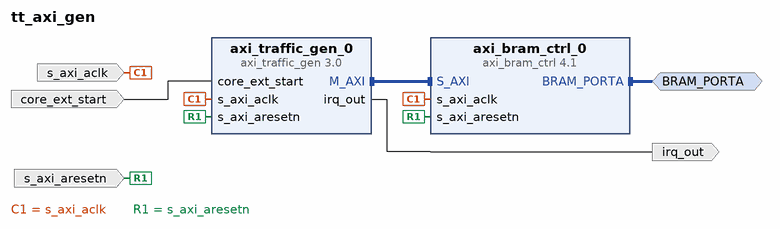
[diagram p0: block diagram of the top level]
# Vivado block design tt_axi_gen, xczu47dr-ffve1156-2LVI-i, Vivado 2020.2
create_bd_design tt_axi_gen

create_bd_intf_port -mode Master -vlnv xilinx.com:interface:bram_rtl:1.0 BRAM_PORTA
set_property -dict {CONFIG.MASTER_TYPE BRAM_CTRL} [get_bd_intf_ports BRAM_PORTA]
create_bd_port -dir I -type clk s_axi_aclk
create_bd_port -dir I -type rst s_axi_aresetn
create_bd_port -dir I core_ext_start
create_bd_port -dir O -type intr irq_out

create_bd_cell -type ip -vlnv xilinx.com:ip:axi_bram_ctrl:4.1 axi_bram_ctrl_0
set_property -dict {CONFIG.SINGLE_PORT_BRAM 1} [get_bd_cells axi_bram_ctrl_0]
create_bd_cell -type ip -vlnv xilinx.com:ip:axi_traffic_gen:3.0 axi_traffic_gen_0
set_property -dict [list \
  CONFIG.ATG_OPTIONS {High Level Traffic} \
  CONFIG.DATA_SIZE_AVG 4 \
  CONFIG.DATA_TRAFFIC_PATTERN Fixed \
  CONFIG.DATA_TRANS_TYPE Write_Only \
  CONFIG.MASTER_BASE_ADDRESS 0x82100000 \
  CONFIG.MASTER_HIGH_ADDRESS 0x821FFFFF \
  CONFIG.TRAFFIC_PROFILE Data \
] [get_bd_cells axi_traffic_gen_0]

# ---- connections ----

connect_bd_intf_net [get_bd_intf_pins axi_traffic_gen_0/M_AXI] [get_bd_intf_pins axi_bram_ctrl_0/S_AXI]
connect_bd_intf_net [get_bd_intf_ports BRAM_PORTA] [get_bd_intf_pins axi_bram_ctrl_0/BRAM_PORTA]
connect_bd_net -net s_axi_aclk_0_1 [get_bd_ports s_axi_aclk] [get_bd_pins axi_traffic_gen_0/s_axi_aclk] [get_bd_pins axi_bram_ctrl_0/s_axi_aclk]
connect_bd_net -net s_axi_aresetn_0_1 [get_bd_ports s_axi_aresetn] \
  [get_bd_pins axi_traffic_gen_0/s_axi_aresetn] [get_bd_pins axi_bram_ctrl_0/s_axi_aresetn]
connect_bd_net -net core_ext_start_0_1 [get_bd_ports core_ext_start] [get_bd_pins axi_traffic_gen_0/core_ext_start]
connect_bd_net [get_bd_pins axi_traffic_gen_0/irq_out] [get_bd_ports irq_out]

# ---- address map ----
assign_bd_address -offset 0x82000000 -range 16M -target_address_space [get_bd_addr_spaces axi_traffic_gen_0/Data] [get_bd_addr_segs axi_bram_ctrl_0/S_AXI/Mem0]

validate_bd_design
save_bd_design
